# Altium schematic sheet [06]EXT_UART.SchDoc
size B
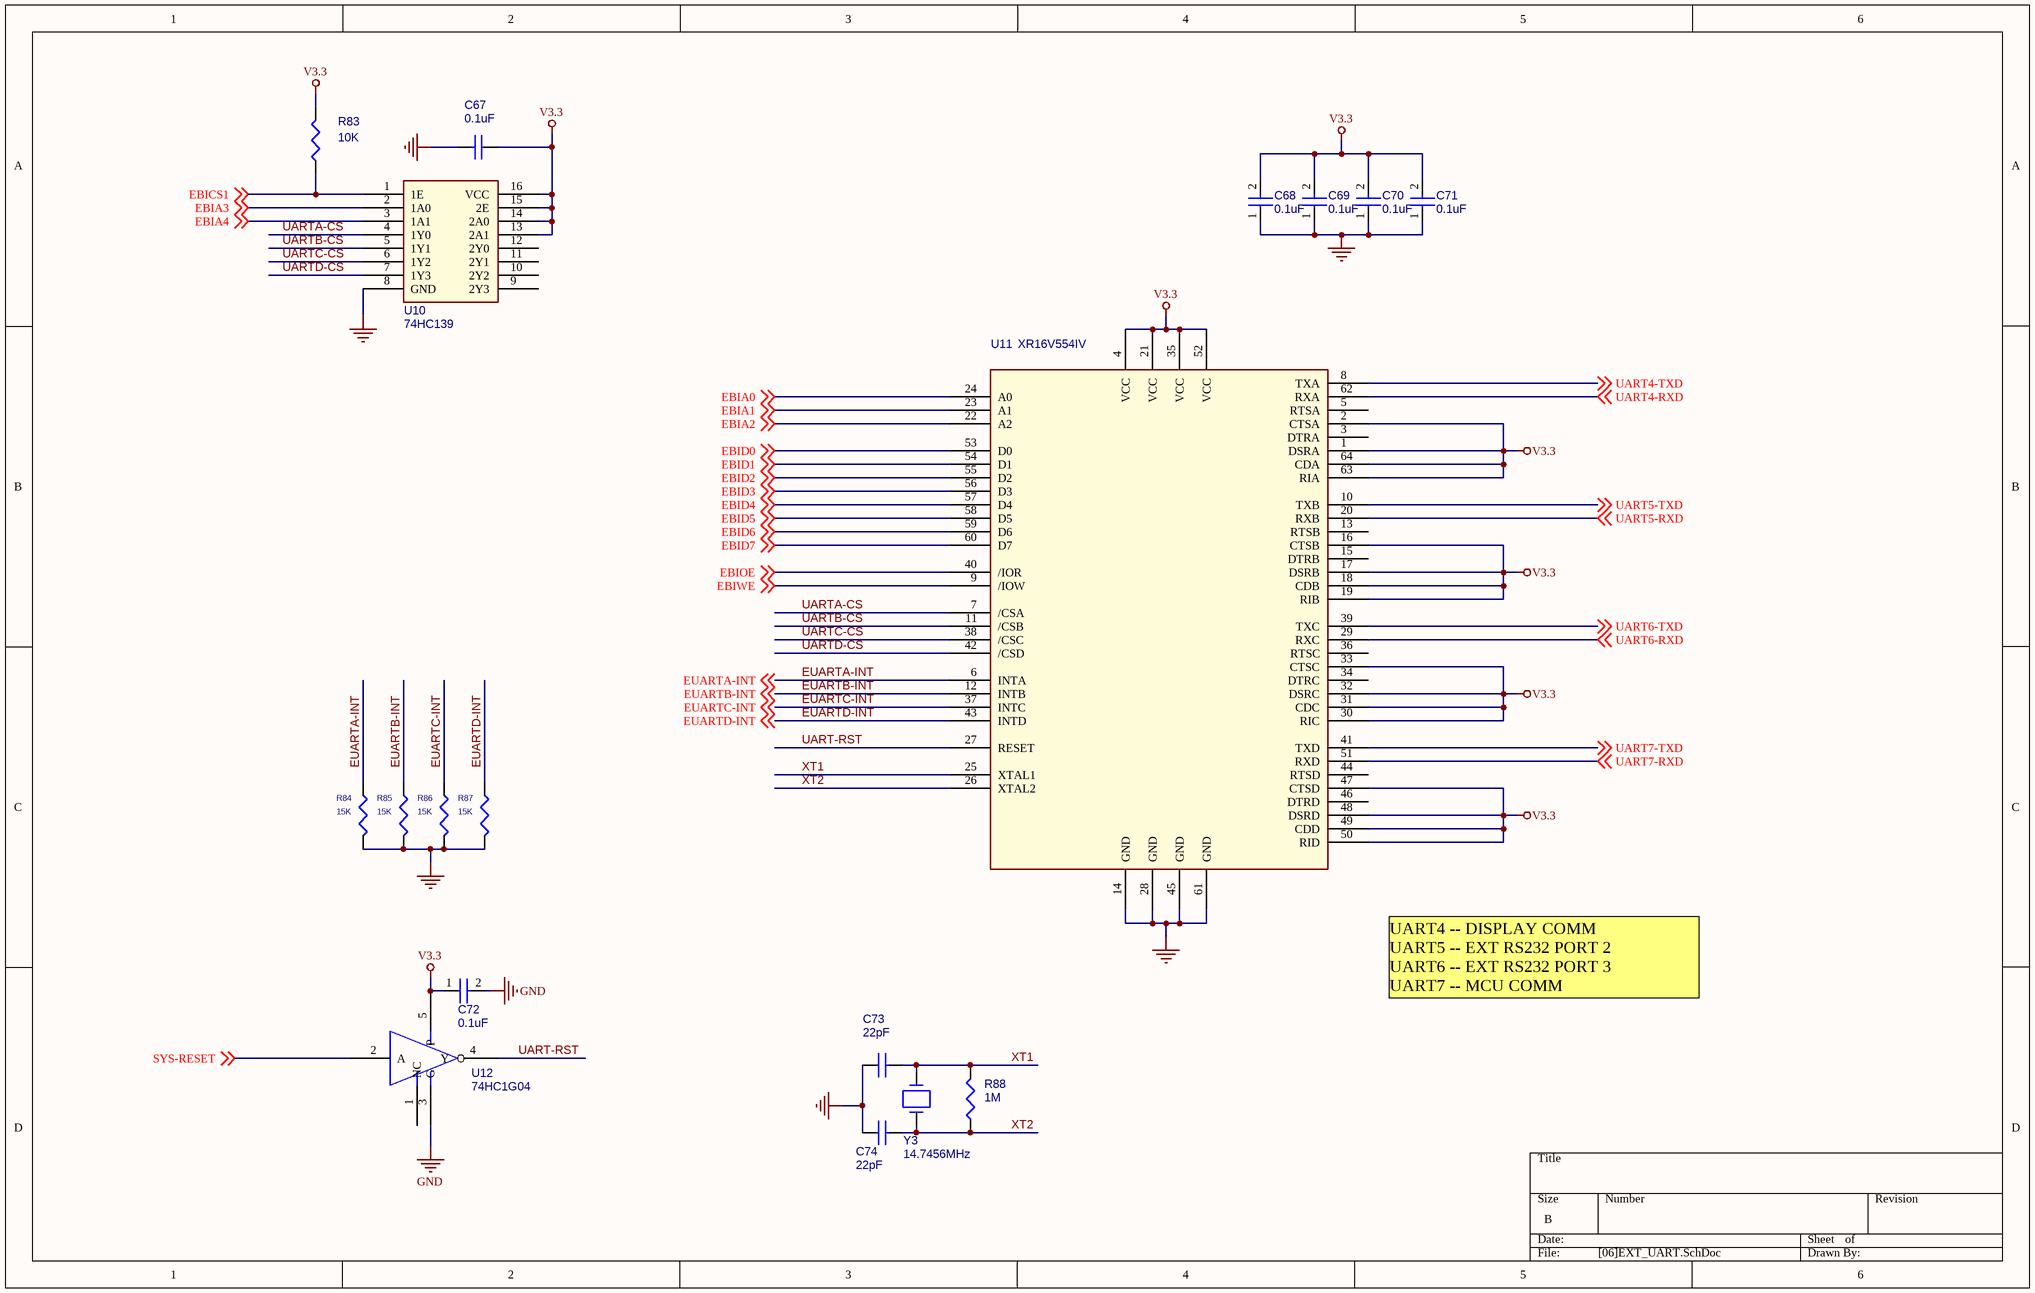
[diagram p0: [06]EXT_UART.SchDoc]

## Parts
C67  0.1uF  [0603]
C68  0.1uF  [0603]
C69  0.1uF  [0603]
C70  0.1uF  [0603]
C71  0.1uF  [0603]
C72  0.1uF  [0603]
C73  22pF  [0603]
C74  22pF  [0603]
R83  10K  [0603]
R84  15K  [0603]
R85  15K  [0603]
R86  15K  [0603]
R87  15K  [0603]
R88  1M  [0603]
U10  74HC139  [SO-16]
U11  XR16V554IV  [LQFP64]
U12  74HC1G04  [SOT753]
Y3  14.7456MHz  [SMD-XTAL-5032]

## Nets
GND: C67.2 C68.1 C69.1 C70.1 C71.1 C72.2 C73.1 C74.1 R84.2 R85.2 R86.2 R87.2 U10.8(GND) U11.14(GND) U11.28(GND) U11.45(GND) U11.61(GND) U12.3(G)
V3.3: C67.1 C68.2 C69.2 C70.2 C71.2 C72.1 R83.2 U10.13(2A1) U10.14(2A0) U10.15(2E) U10.16(VCC) U11.1(DSRA) U11.2(CTSA) U11.4(VCC) U11.16(CTSB) U11.17(DSRB) U11.18(CDB) U11.19(RIB) U11.21(VCC) U11.30(RIC) U11.31(CDC) U11.32(DSRC) U11.33(CTSC) U11.35(VCC) U11.47(CTSD) U11.48(DSRD) U11.49(CDD) U11.50(RID) U11.52(VCC) U11.63(RIA) U11.64(CDA) U12.5(P)
EBIA0: U11.24(A0) ; off-sheet EBIA0
EBIA1: U11.23(A1) ; off-sheet EBIA1
EBIA2: U11.22(A2) ; off-sheet EBIA2
EBIA3: U10.2(1A0) ; off-sheet EBIA3
EBIA4: U10.3(1A1) ; off-sheet EBIA4
EBICS1: R83.1 U10.1(1E) ; off-sheet EBICS1
EBID0: U11.53(D0) ; off-sheet EBID0
EBID1: U11.54(D1) ; off-sheet EBID1
EBID2: U11.55(D2) ; off-sheet EBID2
EBID3: U11.56(D3) ; off-sheet EBID3
EBID4: U11.57(D4) ; off-sheet EBID4
EBID5: U11.58(D5) ; off-sheet EBID5
EBID6: U11.59(D6) ; off-sheet EBID6
EBID7: U11.60(D7) ; off-sheet EBID7
EBIOE: U11.40(/IOR) ; off-sheet EBIOE
EBIWE: U11.9(/IOW) ; off-sheet EBIWE
EUARTA-INT: R84.1 U11.6(INTA) ; off-sheet EUARTA-INT
EUARTB-INT: R85.1 U11.12(INTB) ; off-sheet EUARTB-INT
EUARTC-INT: R86.1 U11.37(INTC) ; off-sheet EUARTC-INT
EUARTD-INT: R87.1 U11.43(INTD) ; off-sheet EUARTD-INT
SYS-RESET: U12.2(A) ; off-sheet SYS-RESET
UART4-RXD: U11.62(RXA) ; off-sheet UART4-RXD
UART4-TXD: U11.8(TXA) ; off-sheet UART4-TXD
UART5-RXD: U11.20(RXB) ; off-sheet UART5-RXD
UART5-TXD: U11.10(TXB) ; off-sheet UART5-TXD
UART6-RXD: U11.29(RXC) ; off-sheet UART6-RXD
UART6-TXD: U11.39(TXC) ; off-sheet UART6-TXD
UART7-RXD: U11.51(RXD) ; off-sheet UART7-RXD
UART7-TXD: U11.41(TXD) ; off-sheet UART7-TXD
UART-RST: U11.27(RESET) U12.4(Y)
UARTA-CS: U10.4(1Y0) U11.7(/CSA)
UARTB-CS: U10.5(1Y1) U11.11(/CSB)
UARTC-CS: U10.6(1Y2) U11.38(/CSC)
UARTD-CS: U10.7(1Y3) U11.42(/CSD)
XT1: C73.2 R88.2 U11.25(XTAL1) Y3.2
XT2: C74.2 R88.1 U11.26(XTAL2) Y3.1

Not connected (* = marked no-connect by the designer): U10 9(2Y3) 10(2Y2) 11(2Y1) 12(2Y0); U11 3(DTRA) 5(RTSA) 13(RTSB) 15(DTRB) 34(DTRC) 36(RTSC) 44(RTSD) 46(DTRD); U12 1(NC)

## Notes on the sheet
- UART4 -- DISPLAY COMM
  UART5 -- EXT RS232 PORT 2
  UART6 -- EXT RS232 PORT 3
  UART7 -- MCU COMM

## Library data of the parts
C67-C72 = CAP NP_Dup2
C73 C74 = CAP_Dup1
R83-R87 = R_Dup1
R88 = RESISTOR
U11 = XR16V554IV_4
U12 = 74LVC1G04GW_SOT353-5: Part  Number: SA00000FX00
Y3 = CRYSTAL